# Altium schematic sheet PAGE05_机场端协议.SchDoc
size A4
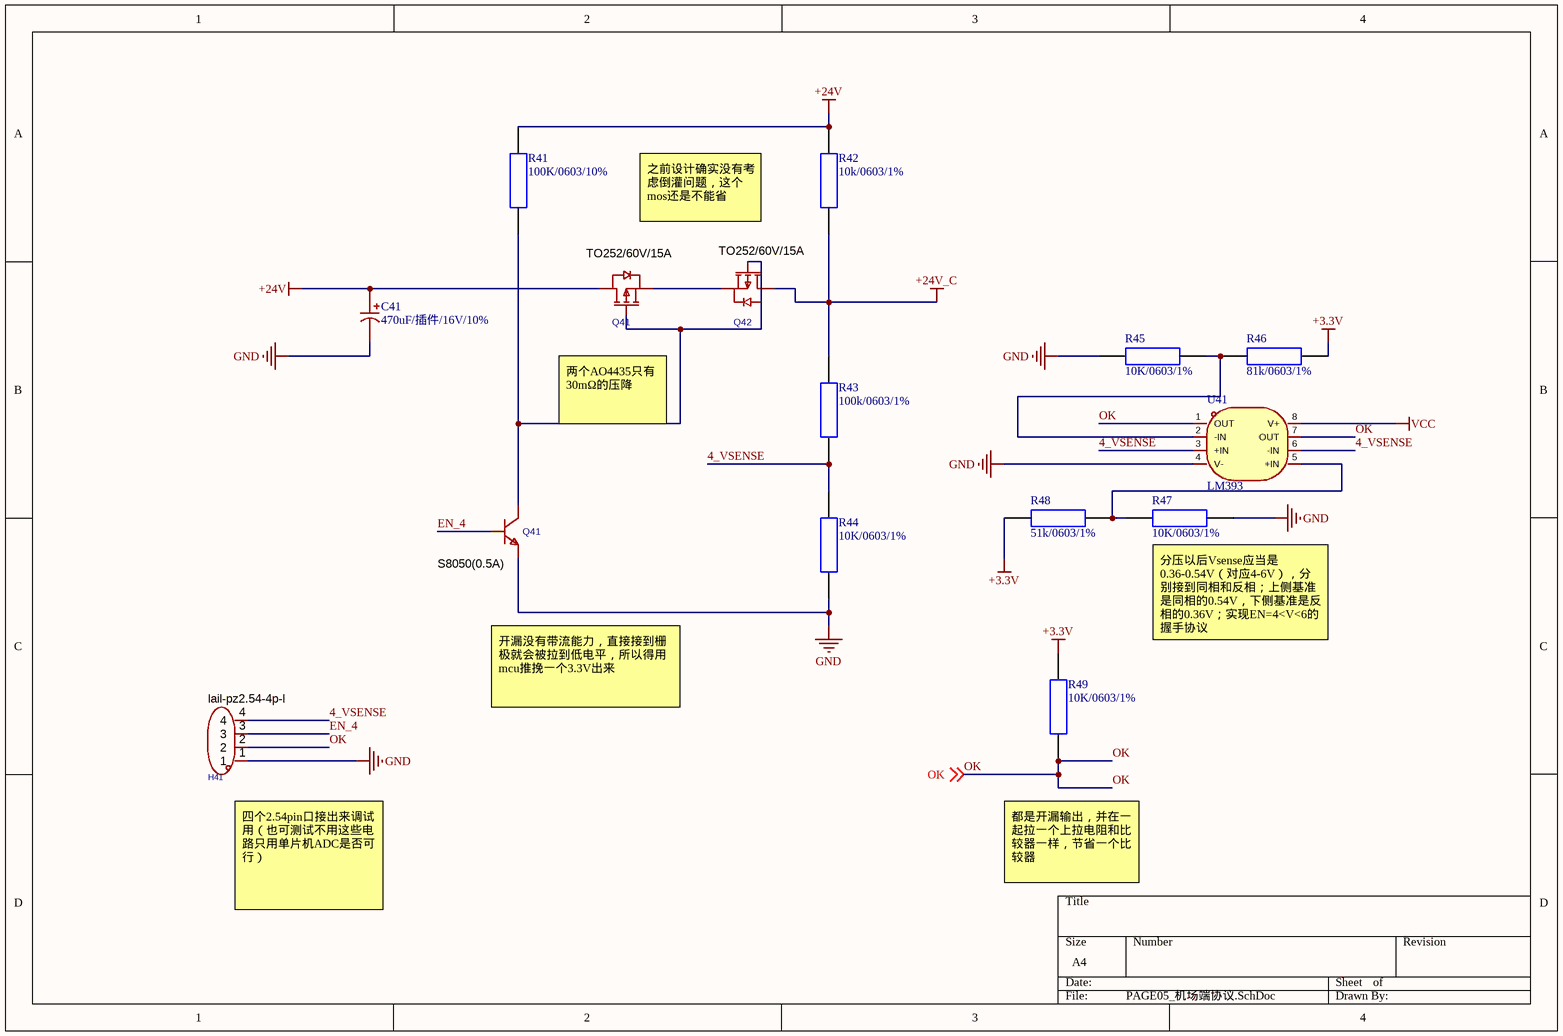
[diagram p0: PAGE05_机场端协议.SchDoc]

## Parts
(Parts that share a designator on the sheet are numbered #1, #2 ... from top to bottom, then left to right.)
C41  470uF/插件/16V/10%  [CAP-TH_BD10.0-P5.00-D0.6-FD-A]
H41  lail-pz2.54-4p-l  [CONN-TH_LAIL-PZ2.54-4P-L]
Q41#1  TO252/60V/15A  [TO-252-2_L6.6-W6.1-P4.57-LS9.9-BR-CW]
Q41#2  S8050(0.5A)  [SOT-23-3_L2.9-W1.3-P1.90-LS2.4-BR]
Q42  TO252/60V/15A  [TO-252-2_L6.6-W6.1-P4.57-LS9.9-BR-CW]
R41  100K/0603/10%  [0603_ding_R]
R42  10k/0603/1%  [0603_ding_R]
R43  100k/0603/1%  [0603_ding_R]
R44  10K/0603/1%  [0603_ding_R]
R45  10K/0603/1%  [0603_ding_R]
R46  81k/0603/1%  [0603_ding_R]
R47  10K/0603/1%  [0603_ding_R]
R48  51k/0603/1%  [0603_ding_R]
R49  10K/0603/1%  [0603_ding_R]
U41  LM393  [SOIC-8_L5.0-W4.0-P1.27-LS6.0-BL]

## Nets
+3.3V: R46.1 R48.1 R49.1
+24V: C41.1 Q41#1.2(D) R41.2 R42.2
+24V_C: Q42.2(D) R42.1 R43.2
GND: C41.2 H41.1 Q41#2.2(E) R44.1 R45.2 R47.2 U41.4(V-)
VCC: U41.8(V+)
4_VSENSE: H41.4 R43.1 R44.2 U41.3(+IN) U41.6(-IN)
EN_4: H41.3 Q41#2.1(B)
OK: H41.2 R49.2 U41.1(OUT) U41.7(OUT) ; off-sheet OK
NetQ41#1_1: Q41#1.1(G) Q41#2.3(C) Q42.1(G) R41.1
NetQ41#1_3: Q41#1.3(S) Q42.3(S)
NetR45_1: R45.1 R46.2 U41.2(-IN)
NetR47_1: R47.1 R48.2 U41.5(+IN)

## Notes on the sheet
- 之前设计确实没有考虑倒灌问题，这个mos还是不能省
- (near Q41#1) 两个AO4435只有30mΩ的压降
- (near R47) 分压以后Vsense应当是0.36-0.54V（对应4-6V），分别接到同相和反相；上侧基准是同相的0.54V，下侧基准是反相的0.36V；实现EN=4<V<6的握手协议
- 开漏没有带流能力，直接接到栅极就会被拉到低电平，所以得用mcu推挽一个3.3V出来
- (near H41) 四个2.54pin口接出来调试用（也可测试不用这些电路只用单片机ADC是否可行）
- 都是开漏输出，并在一起拉一个上拉电阻和比较器一样，节省一个比较器

## Library data of the parts
C41 = Cbig
H41 = lail-pz2.54-4p-l: 插针结构:1x4P;间距:2.54mm;圆针/方针:方针;安装方式:直插;排数:单排;总PIN位数:4P;额定电流:3A;额定电压:250V;配合针长度:6mm;塑高:2.5mm;端接针长度:3mm;触头材质:黄铜;触头镀层:金;工作温度:-25℃~+80℃;颜色:黑色;; Manufacturer: LAILAN(莱联); AddInBom: yes; ModelId: 112b012cb4004446aa5386c9c86d05f0; ModelTransform: 400.039,100,0,0,0,0,0,0,-118.11; Pin Structure: 1x4P; Pitch: 2.54mm; Circluar Pins/Square Pins: 方针; Current Rating: 3A; Voltage Rating (Max): 250V; LCSC Part Name: 1x4P 间距:2.54mm 方针 直插; SupplierPart: C54950602; ManufacturerPart: LAIL-PZ2.54-4P-L; Supplier Footprint: 插件,P=2.54mm; JLCPCB Part Class: Extended Part; Datasheet: https://item.szlcsc.com/datasheet/LAIL-PZ2.54-4P-L/58519955.html; Supplier: LCSC; ConvertToPcb: yes; SymbolName: LAIL-PZ2.54-4P-L; FootprintName: CONN-TH_LAIL-PZ2.54-4P-L; ModelName: CONN-TH_LAIL-PZ2.54-4P-L; Mounting Type: 直插; Number of Rows: 单排; Number of Pins: 4P; Length of Mating Pin: 6mm; Insulation Height: 2.5mm; Length of End Connection Pin: 3mm; Contact Material: 黄铜; Contact Plating: 金; Operating Temperature: -25℃~+80℃; Color: 黑色
Q41#1 Q42 = aod4185_c400894: 数量:1个P沟道;漏源电压(Vdss):40V;连续漏极电流(Id):40A;导通电阻(RDS(on)):15mΩ@10V;耗散功率(Pd):62.5W;阈值电压(Vgs(th)):3V;; Manufacturer: AOS; AddInBom: yes; ModelId: dee852f3c6b348a2b9d5be5dd3244081; ModelName: TO-252-3_L6.6-W6.1-P4.57-LS9.9-BR-CW; ModelTransform: 258.97184,390.1567,0,90,0,0,-35.433,0,0; Number: 1个P沟道; Drain to Source Voltage: 40V; Current - Continuous Drain(Id): 40A; Pd - Power Dissipation: 62.5W; Gate Threshold Voltage (Vgs(th)): 3V; Gate Charge(Qg): 55nC@10V; Input Capacitance(Ciss): 2.55nF; Reverse Transfer Capacitance (Crss@Vds): 190pF; Type: P沟道; Output Capacitance(Coss): 280pF; Vgs: ±20V; Symbol: AOD4185_C400894; LCSC Part Name: 1个P沟道 耐压:40V 电流:40A; SupplierPart: C400894; ManufacturerPart: AOD4185; Supplier Footprint: TO-252(DPAK); JLCPCB Part Class: Extended Part; Datasheet: https://item.szlcsc.com/datasheet/AOD4185/385415.html; Supplier: LCSC; ConvertToPcb: yes; FootprintName: TO-252-3_L6.6-W6.1-P4.57-LS9.9-BR-CW; RDS(on): 15mΩ@10V; Operating Temperature: -55℃~+175℃; Configuration: -
Q41#2 = s8050(0.5a): 晶体管类型:NPN;集电极电流(Ic):500mA;集射极击穿电压(Vceo):25V;耗散功率(Pd):300mW;直流电流增益(hFE):120;; Manufacturer: EIC; AddInBom: yes; ModelId: c62791f0466c4ae2a892c056b845b0ca; ModelName: SOT-23-3P_L2.9-W1.3-H1.0-LS2.4-P0.95; ModelTransform: 98.425,114.173,0,180,0,0,0.0005,-0.0005,0; type: NPN; Current - Collector(Ic): 500mA; Collector - Emitter Voltage VCEO: 25V; Pd - Power Dissipation: 300mW; DC Current Gain: 120; Transition frequency(fT): 150MHz; Current - Collector Cutoff: 100nA; Vce Saturation(VCE(sat)): 600mV; Emitter-Base Voltage(Vebo): 5V; Number: 1个NPN; Symbol: S8050(0.5A); LCSC Part Name: 电流:0.5A 电压:25V; SupplierPart: C3014350; ManufacturerPart: S8050(0.5A); Supplier Footprint: SOT-23; JLCPCB Part Class: Extended Part; Datasheet: https://item.szlcsc.com/datasheet/S8050(0.5A)/3524496.html; Supplier: LCSC; ConvertToPcb: yes; FootprintName: SOT-23-3_L2.9-W1.3-P1.90-LS2.4-BR
R41-R49 = RES